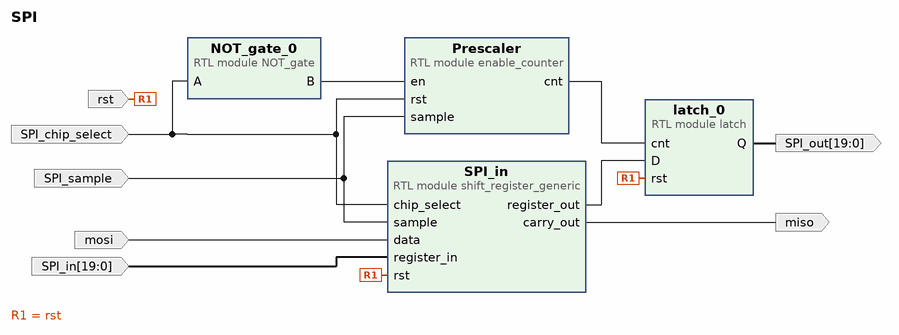
[diagram p0: block diagram of the top level]
# Vivado block design SPI, xc7z020clg400-1, Vivado 2023.2
create_bd_design SPI

create_bd_port -dir I mosi
create_bd_port -dir I SPI_chip_select
create_bd_port -dir I rst
create_bd_port -dir O miso
create_bd_port -dir I SPI_sample
create_bd_port -dir I -from 19 -to 0 SPI_in
create_bd_port -dir O -from 19 -to 0 SPI_out

create_bd_cell -type module -reference shift_register_generic SPI_in
set_property -dict {CONFIG.register_length 20} [get_bd_cells SPI_in]
create_bd_cell -type module -reference latch latch_0
set_property -dict {CONFIG.data_length 20} [get_bd_cells latch_0]
create_bd_cell -type module -reference enable_counter Prescaler
set_property -dict {CONFIG.data_length 20} [get_bd_cells Prescaler]
create_bd_cell -type module -reference NOT_gate NOT_gate_0

# ---- connections ----

connect_bd_net -net MC_data_1 [get_bd_ports mosi] [get_bd_pins SPI_in/data]
connect_bd_net [get_bd_pins NOT_gate_0/B] [get_bd_pins Prescaler/en]
connect_bd_net [get_bd_ports SPI_chip_select] [get_bd_pins Prescaler/rst] [get_bd_pins SPI_in/chip_select] [get_bd_pins NOT_gate_0/A]
connect_bd_net -net clock_1 [get_bd_ports SPI_sample] [get_bd_pins Prescaler/sample] [get_bd_pins SPI_in/sample]
connect_bd_net -net enable_counter_0_cnt [get_bd_pins Prescaler/cnt] [get_bd_pins latch_0/cnt]
connect_bd_net [get_bd_pins latch_0/Q] [get_bd_ports SPI_out]
connect_bd_net -net register_in_0_1 [get_bd_ports SPI_in] [get_bd_pins SPI_in/register_in]
connect_bd_net [get_bd_ports rst] [get_bd_pins SPI_in/rst] [get_bd_pins latch_0/rst]
connect_bd_net -net shift_register_input_carry_out [get_bd_pins SPI_in/carry_out] [get_bd_ports miso]
connect_bd_net -net shift_register_input_register_out [get_bd_pins SPI_in/register_out] [get_bd_pins latch_0/D]

validate_bd_design
save_bd_design
